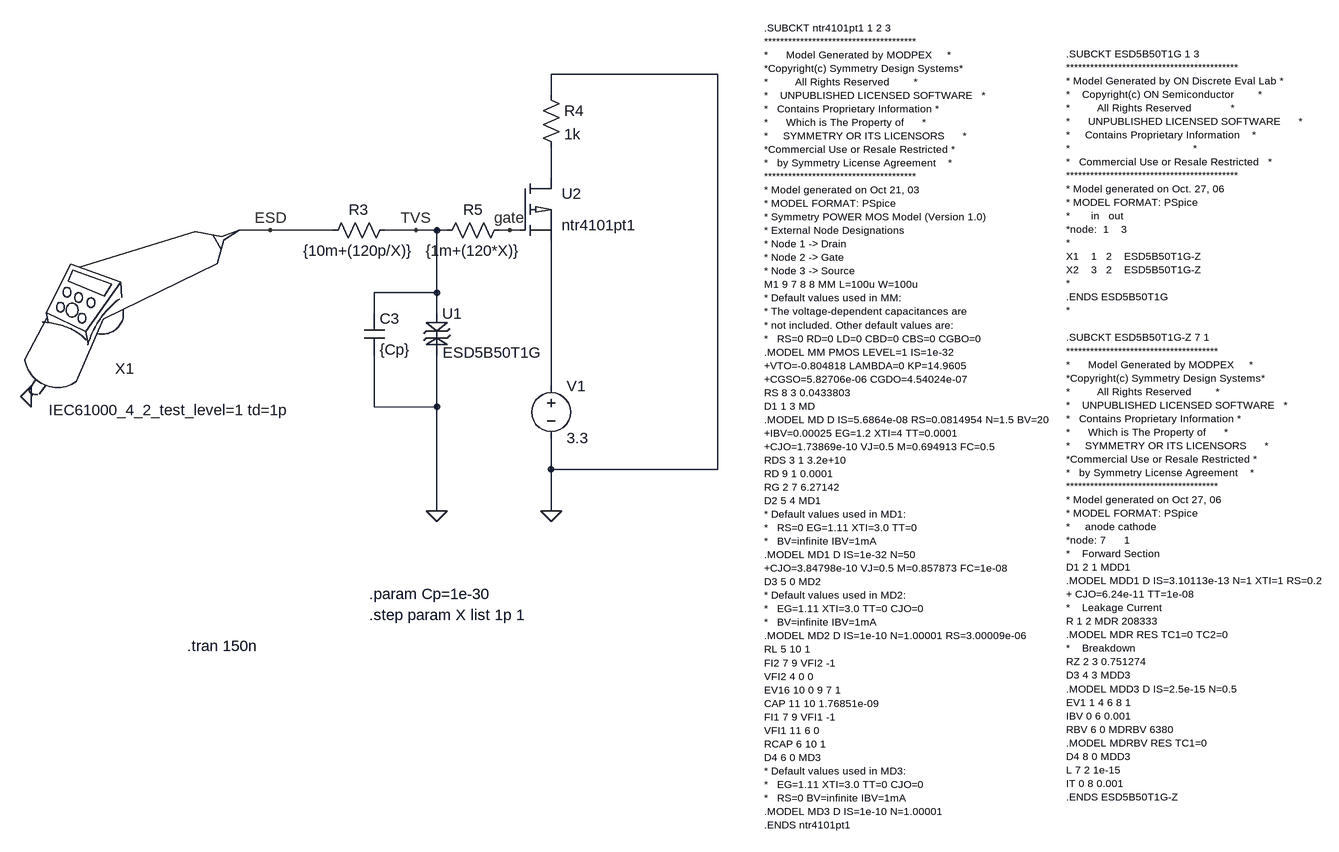
[diagram p0: schematic Pmos_ESD_protection.asc]
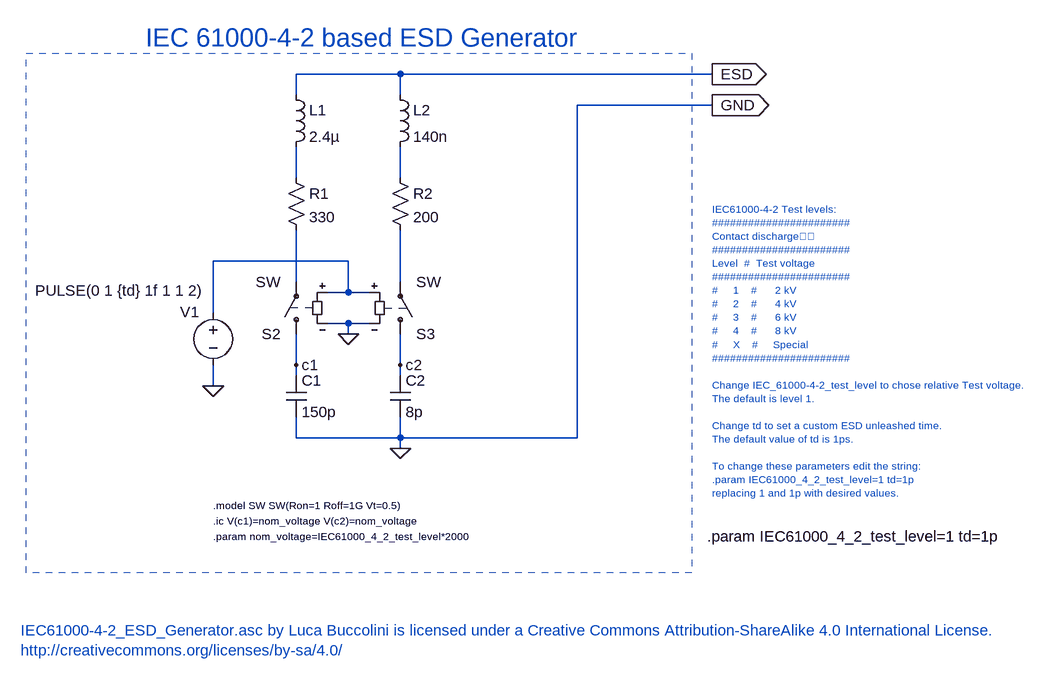
[diagram p1: sub-circuit iec61000-4-2_esd_generator.asc]
Pmos_ESD_protection.asc, the LTspice schematic file:
Version 4
SHEET 1 4832 1752
WIRE 3856 640 3600 640
WIRE 3600 672 3600 640
WIRE 3600 800 3600 752
WIRE 3168 880 3120 880
WIRE 3264 880 3168 880
WIRE 3392 880 3344 880
WIRE 3424 880 3392 880
WIRE 3440 880 3424 880
WIRE 3536 880 3520 880
WIRE 3552 880 3536 880
WIRE 3424 976 3424 880
WIRE 3424 976 3328 976
WIRE 3328 1008 3328 976
WIRE 3424 1008 3424 976
WIRE 3600 1120 3600 896
WIRE 3328 1152 3328 1072
WIRE 3424 1152 3424 1072
WIRE 3424 1152 3328 1152
WIRE 3600 1248 3600 1200
WIRE 3856 1248 3856 640
WIRE 3856 1248 3600 1248
WIRE 3424 1312 3424 1152
WIRE 3600 1312 3600 1248
FLAG 3600 1312 0
FLAG 3536 880 gate
FLAG 3424 1312 0
FLAG 3168 880 ESD
FLAG 3392 880 TVS
FLAG 2800 1136 0
SYMBOL res 3360 864 R90
WINDOW 0 0 56 VBottom 2
WINDOW 3 32 56 VTop 2
SYMATTR InstName R3
SYMATTR Value {10m+(120p/X)}
SYMBOL voltage 3600 1104 R0
SYMATTR InstName V1
SYMATTR Value 3.3
SYMBOL res 3584 656 R0
SYMATTR InstName R4
SYMATTR Value 1k
SYMBOL cap 3312 1008 R0
SYMATTR InstName C3
SYMATTR Value {Cp}
SYMBOL res 3536 864 R90
WINDOW 0 0 56 VBottom 2
WINDOW 3 32 56 VTop 2
SYMATTR InstName R5
SYMATTR Value {1m+(120*X)}
SYMBOL IEC61000-4-2_ESD_Generator 2880 1024 R0
WINDOW 0 49 69 Left 2
WINDOW 39 -53 133 Left 2
SYMATTR InstName X1
SYMATTR SpiceLine IEC61000_4_2_test_level=1 td=1p
SYMBOL Xtransil_ST_BI 3408 1008 R0
SYMATTR InstName U1
SYMATTR SpiceModel ESD5B50T1G
SYMBOL xpmos 3552 800 R0
SYMATTR InstName U2
SYMATTR SpiceModel ntr4101pt1
TEXT 3320 1440 Left 2 !.param Cp=1e-30
TEXT 3320 1472 Left 2 !.step param X list 1p 1
TEXT 3040 1520 Left 2 !.tran 150n
TEXT 4392 608 Left 1 !.SUBCKT ESD5B50T1G 1 3\n*******************************************\n* Model Generated by ON Discrete Eval Lab *\n*    Copyright(c) ON Semiconductor        *\n*         All Rights Reserved             *\n*      UNPUBLISHED LICENSED SOFTWARE      *\n*     Contains Proprietary Information    *\n*                                         *\n*   Commercial Use or Resale Restricted   *\n*******************************************\n* Model generated on Oct. 27, 06\n* MODEL FORMAT: PSpice\n*       in   out   \n*node:  1    3    \n*\nX1    1   2    ESD5B50T1G-Z \nX2    3   2    ESD5B50T1G-Z \n*\n.ENDS ESD5B50T1G \n*\n \n.SUBCKT ESD5B50T1G-Z 7 1\n**************************************\n*      Model Generated by MODPEX     *\n*Copyright(c) Symmetry Design Systems*\n*         All Rights Reserved        *\n*    UNPUBLISHED LICENSED SOFTWARE   *\n*   Contains Proprietary Information *\n*      Which is The Property of      *\n*     SYMMETRY OR ITS LICENSORS      *\n*Commercial Use or Resale Restricted *\n*   by Symmetry License Agreement    *\n**************************************\n* Model generated on Oct 27, 06\n* MODEL FORMAT: PSpice\n*     anode cathode\n*node: 7      1\n*    Forward Section\nD1 2 1 MDD1\n.MODEL MDD1 D IS=3.10113e-13 N=1 XTI=1 RS=0.2\n+ CJO=6.24e-11 TT=1e-08\n*    Leakage Current\nR 1 2 MDR 208333\n.MODEL MDR RES TC1=0 TC2=0\n*    Breakdown\nRZ 2 3 0.751274 \nD3 4 3 MDD3\n.MODEL MDD3 D IS=2.5e-15 N=0.5 \nEV1 1 4 6 8 1\nIBV 0 6 0.001\nRBV 6 0 MDRBV 6380\n.MODEL MDRBV RES TC1=0\nD4 8 0 MDD3\nL 7 2 1e-15\nIT 0 8 0.001\n.ENDS ESD5B50T1G-Z
TEXT 3928 568 Left 1 !.SUBCKT ntr4101pt1 1 2 3\n**************************************\n*      Model Generated by MODPEX     *\n*Copyright(c) Symmetry Design Systems*\n*         All Rights Reserved        *\n*    UNPUBLISHED LICENSED SOFTWARE   *\n*   Contains Proprietary Information *\n*      Which is The Property of      *\n*     SYMMETRY OR ITS LICENSORS      *\n*Commercial Use or Resale Restricted *\n*   by Symmetry License Agreement    *\n**************************************\n* Model generated on Oct 21, 03\n* MODEL FORMAT: PSpice\n* Symmetry POWER MOS Model (Version 1.0)\n* External Node Designations\n* Node 1 -> Drain\n* Node 2 -> Gate\n* Node 3 -> Source\nM1 9 7 8 8 MM L=100u W=100u\n* Default values used in MM:\n* The voltage-dependent capacitances are\n* not included. Other default values are:\n*   RS=0 RD=0 LD=0 CBD=0 CBS=0 CGBO=0\n.MODEL MM PMOS LEVEL=1 IS=1e-32\n+VTO=-0.804818 LAMBDA=0 KP=14.9605\n+CGSO=5.82706e-06 CGDO=4.54024e-07\nRS 8 3 0.0433803\nD1 1 3 MD\n.MODEL MD D IS=5.6864e-08 RS=0.0814954 N=1.5 BV=20\n+IBV=0.00025 EG=1.2 XTI=4 TT=0.0001\n+CJO=1.73869e-10 VJ=0.5 M=0.694913 FC=0.5\nRDS 3 1 3.2e+10\nRD 9 1 0.0001\nRG 2 7 6.27142\nD2 5 4 MD1\n* Default values used in MD1:\n*   RS=0 EG=1.11 XTI=3.0 TT=0\n*   BV=infinite IBV=1mA\n.MODEL MD1 D IS=1e-32 N=50\n+CJO=3.84798e-10 VJ=0.5 M=0.857873 FC=1e-08\nD3 5 0 MD2\n* Default values used in MD2:\n*   EG=1.11 XTI=3.0 TT=0 CJO=0\n*   BV=infinite IBV=1mA\n.MODEL MD2 D IS=1e-10 N=1.00001 RS=3.00009e-06\nRL 5 10 1\nFI2 7 9 VFI2 -1\nVFI2 4 0 0\nEV16 10 0 9 7 1\nCAP 11 10 1.76851e-09\nFI1 7 9 VFI1 -1\nVFI1 11 6 0\nRCAP 6 10 1\nD4 6 0 MD3\n* Default values used in MD3:\n*   EG=1.11 XTI=3.0 TT=0 CJO=0\n*   RS=0 BV=infinite IBV=1mA\n.MODEL MD3 D IS=1e-10 N=1.00001\n.ENDS ntr4101pt1

iec61000-4-2_esd_generator.asc, the sub-circuit schematic file:
Version 4
SHEET 1 880 680
WIRE -1312 -1056 -1472 -1056
WIRE -832 -1056 -1312 -1056
WIRE -1472 -1024 -1472 -1056
WIRE -1312 -1024 -1312 -1056
WIRE -832 -1008 -1040 -1008
WIRE -1472 -896 -1472 -944
WIRE -1312 -896 -1312 -944
WIRE -1392 -768 -1600 -768
WIRE -1472 -736 -1472 -816
WIRE -1312 -736 -1312 -816
WIRE -1392 -720 -1392 -768
WIRE -1392 -720 -1424 -720
WIRE -1360 -720 -1392 -720
WIRE -1600 -688 -1600 -768
WIRE -1392 -672 -1424 -672
WIRE -1360 -672 -1392 -672
WIRE -1392 -656 -1392 -672
WIRE -1472 -608 -1472 -656
WIRE -1312 -608 -1312 -656
WIRE -1472 -592 -1472 -608
WIRE -1312 -592 -1312 -608
WIRE -1600 -576 -1600 -608
WIRE -1472 -496 -1472 -528
WIRE -1312 -496 -1312 -528
WIRE -1312 -496 -1472 -496
WIRE -1040 -496 -1040 -1008
WIRE -1040 -496 -1312 -496
WIRE -1312 -480 -1312 -496
FLAG -1600 -576 0
FLAG -1312 -480 0
FLAG -1472 -608 c1
FLAG -1312 -608 c2
FLAG -1392 -656 0
FLAG -832 -1056 ESD
IOPIN -832 -1056 Out
FLAG -832 -1008 GND
IOPIN -832 -1008 Out
SYMBOL voltage -1600 -704 R0
WINDOW 123 0 0 Left 2
WINDOW 39 0 0 Left 2
WINDOW 0 -51 14 Left 2
WINDOW 3 -274 -19 Left 2
SYMATTR InstName V1
SYMATTR Value PULSE(0 1 {td} 1f 1 1 2)
SYMBOL ind -1488 -1040 R0
SYMATTR InstName L1
SYMATTR Value 2.4µ
SYMBOL ind -1328 -1040 R0
SYMATTR InstName L2
SYMATTR Value 140n
SYMBOL res -1488 -912 R0
SYMATTR InstName R1
SYMATTR Value 330
SYMBOL res -1328 -912 R0
SYMATTR InstName R2
SYMATTR Value 200
SYMBOL cap -1488 -592 R0
SYMATTR InstName C1
SYMATTR Value 150p
SYMBOL cap -1328 -592 R0
SYMATTR InstName C2
SYMATTR Value 8p
SYMBOL sw -1472 -640 R180
SYMATTR InstName S2
SYMBOL sw -1312 -640 M180
SYMATTR InstName S3
TEXT -1600 -392 Left 1 !.model SW SW(Ron=1 Roff=1G Vt=0.5)
TEXT -1600 -368 Left 1 !.ic V(c1)=nom_voltage V(c2)=nom_voltage
TEXT -1704 -1112 Left 4 ;IEC 61000-4-2 based ESD Generator
TEXT -1600 -344 Left 1 !.param nom_voltage=IEC61000_4_2_test_level*2000
TEXT -840 -344 Left 2 !.param IEC61000_4_2_test_level=1 td=1p
TEXT -1896 -200 Left 2 ;IEC61000-4-2_ESD_Generator.asc by Luca Buccolini is licensed under a Creative Commons Attribution-ShareAlike 4.0 International License.\nhttp://creativecommons.org/licenses/by-sa/4.0/
TEXT -832 -848 Left 1 ;IEC61000-4-2 Test levels:\n#######################\nContact discharge         \n#######################\nLevel  #  Test voltage   \n#######################\n#     1    #      2 kV         \n#     2    #      4 kV         \n#     3    #      6 kV         \n#     4    #      8 kV         \n#     X    #     Special     \n#######################\n \nChange IEC_61000-4-2_test_level to chose relative Test voltage. \nThe default is level 1.\n \nChange td to set a custom ESD unleashed time.\nThe default value of td is 1ps.\n \nTo change these parameters edit the string:\n.param IEC61000_4_2_test_level=1 td=1p\nreplacing 1 and 1p with desired values.
RECTANGLE Normal -1888 -1088 -864 -288 2

The netlist it stands for:
* Pmos_ESD_protection.asc
R3 TVS ESD {10m+(120p/X)}
V1 N002 0 3.3
R4 0 N001 1k
C3 TVS 0 {Cp}
R5 gate TVS {1m+(120*X)}
XX1 ESD 0 iec61000-4-2_esd_generator params: IEC61000_4_2_test_level=1 td=1p
XU1 TVS 0 ESD5B50T1G  ; pins + -
XU2 N001 gate N002 ntr4101pt1  ; pins D G S

* block symbol definitions
.subckt iec61000-4-2_esd_generator ESD GND
V1 N003 0 PULSE(0 1 {td} 1f 1 1 2)
L1 ESD N001 2.4µ
L2 ESD N002 140n
R1 N001 N004 330
R2 N002 N005 200
C1 c1 0 150p
C2 c2 0 8p
S2 c1 N004 N003 0 SW
S3 c2 N005 N003 0 SW
.model SW SW(Ron=1 Roff=1G Vt=0.5)
.ic V(c1)=nom_voltage V(c2)=nom_voltage
* IEC 61000-4-2 based ESD Generator
.param nom_voltage=IEC61000_4_2_test_level*2000
.param IEC61000_4_2_test_level=1 td=1p
* IEC61000-4-2_ESD_Generator.asc by Luca Buccolini is licensed under a Creative Commons Attribution-ShareAlike 4.0 International License.
* http://creativecommons.org/licenses/by-sa/4.0/
* IEC61000-4-2 Test levels:
* #######################
* Contact discharge
* #######################
* Level  #  Test voltage
* #######################
* #     1    #      2 kV
* #     2    #      4 kV
* #     3    #      6 kV
* #     4    #      8 kV
* #     X    #     Special
* #######################
* Change IEC_61000-4-2_test_level to chose relative Test voltage.
* The default is level 1.
* Change td to set a custom ESD unleashed time.
* The default value of td is 1ps.
* To change these parameters edit the string:
* .param IEC61000_4_2_test_level=1 td=1p
* replacing 1 and 1p with desired values.
.ends iec61000-4-2_esd_generator

.param Cp=1e-30
.step param X list 1p 1
.tran 150n
.SUBCKT ESD5B50T1G 1 3
*******************************************
* Model Generated by ON Discrete Eval Lab *
*    Copyright(c) ON Semiconductor        *
*         All Rights Reserved             *
*      UNPUBLISHED LICENSED SOFTWARE      *
*     Contains Proprietary Information    *
*                                         *
*   Commercial Use or Resale Restricted   *
*******************************************
* Model generated on Oct. 27, 06
* MODEL FORMAT: PSpice
*       in   out
*node:  1    3
*
X1    1   2    ESD5B50T1G-Z
X2    3   2    ESD5B50T1G-Z
*
.ENDS ESD5B50T1G
*
.SUBCKT ESD5B50T1G-Z 7 1
**************************************
*      Model Generated by MODPEX     *
*Copyright(c) Symmetry Design Systems*
*         All Rights Reserved        *
*    UNPUBLISHED LICENSED SOFTWARE   *
*   Contains Proprietary Information *
*      Which is The Property of      *
*     SYMMETRY OR ITS LICENSORS      *
*Commercial Use or Resale Restricted *
*   by Symmetry License Agreement    *
**************************************
* Model generated on Oct 27, 06
* MODEL FORMAT: PSpice
*     anode cathode
*node: 7      1
*    Forward Section
D1 2 1 MDD1
.MODEL MDD1 D IS=3.10113e-13 N=1 XTI=1 RS=0.2
+ CJO=6.24e-11 TT=1e-08
*    Leakage Current
R 1 2 MDR 208333
.MODEL MDR RES TC1=0 TC2=0
*    Breakdown
RZ 2 3 0.751274
D3 4 3 MDD3
.MODEL MDD3 D IS=2.5e-15 N=0.5
EV1 1 4 6 8 1
IBV 0 6 0.001
RBV 6 0 MDRBV 6380
.MODEL MDRBV RES TC1=0
D4 8 0 MDD3
L 7 2 1e-15
IT 0 8 0.001
.ENDS ESD5B50T1G-Z
.SUBCKT ntr4101pt1 1 2 3
**************************************
*      Model Generated by MODPEX     *
*Copyright(c) Symmetry Design Systems*
*         All Rights Reserved        *
*    UNPUBLISHED LICENSED SOFTWARE   *
*   Contains Proprietary Information *
*      Which is The Property of      *
*     SYMMETRY OR ITS LICENSORS      *
*Commercial Use or Resale Restricted *
*   by Symmetry License Agreement    *
**************************************
* Model generated on Oct 21, 03
* MODEL FORMAT: PSpice
* Symmetry POWER MOS Model (Version 1.0)
* External Node Designations
* Node 1 -> Drain
* Node 2 -> Gate
* Node 3 -> Source
M1 9 7 8 8 MM L=100u W=100u
* Default values used in MM:
* The voltage-dependent capacitances are
* not included. Other default values are:
*   RS=0 RD=0 LD=0 CBD=0 CBS=0 CGBO=0
.MODEL MM PMOS LEVEL=1 IS=1e-32
+VTO=-0.804818 LAMBDA=0 KP=14.9605
+CGSO=5.82706e-06 CGDO=4.54024e-07
RS 8 3 0.0433803
D1 1 3 MD
.MODEL MD D IS=5.6864e-08 RS=0.0814954 N=1.5 BV=20
+IBV=0.00025 EG=1.2 XTI=4 TT=0.0001
+CJO=1.73869e-10 VJ=0.5 M=0.694913 FC=0.5
RDS 3 1 3.2e+10
RD 9 1 0.0001
RG 2 7 6.27142
D2 5 4 MD1
* Default values used in MD1:
*   RS=0 EG=1.11 XTI=3.0 TT=0
*   BV=infinite IBV=1mA
.MODEL MD1 D IS=1e-32 N=50
+CJO=3.84798e-10 VJ=0.5 M=0.857873 FC=1e-08
D3 5 0 MD2
* Default values used in MD2:
*   EG=1.11 XTI=3.0 TT=0 CJO=0
*   BV=infinite IBV=1mA
.MODEL MD2 D IS=1e-10 N=1.00001 RS=3.00009e-06
RL 5 10 1
FI2 7 9 VFI2 -1
VFI2 4 0 0
EV16 10 0 9 7 1
CAP 11 10 1.76851e-09
FI1 7 9 VFI1 -1
VFI1 11 6 0
RCAP 6 10 1
D4 6 0 MD3
* Default values used in MD3:
*   EG=1.11 XTI=3.0 TT=0 CJO=0
*   RS=0 BV=infinite IBV=1mA
.MODEL MD3 D IS=1e-10 N=1.00001
.ENDS ntr4101pt1
.backanno
.end